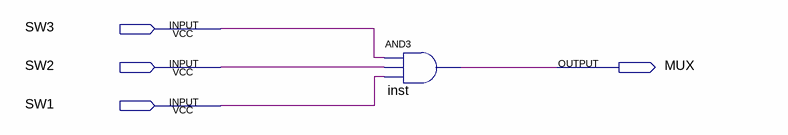
[diagram p0: schematic sheet]
// Quartus schematic mux.bdf as structural Verilog: 1 symbols, 4 pins
module mux (
  input  SW3,
  input  SW2,
  input  SW1,
  output MUX
);

  and inst (MUX, SW3, SW2, SW1);
endmodule
